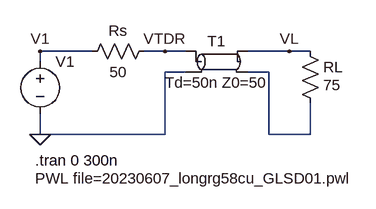
[diagram p0: schematic tline_test.asc]
tline_test.asc, the LTspice schematic file:
Version 4
SHEET 1 1272 680
WIRE 16 144 -64 144
WIRE 128 144 96 144
WIRE 160 144 128 144
WIRE 320 144 256 144
WIRE 352 144 320 144
WIRE -64 160 -64 144
WIRE 160 176 128 176
WIRE 288 176 256 176
WIRE -64 272 -64 240
WIRE 128 272 128 176
WIRE 128 272 -64 272
WIRE 288 272 288 176
WIRE 352 272 352 224
WIRE 352 272 288 272
FLAG -64 272 0
FLAG 320 144 VL
FLAG -64 144 V1
FLAG 128 144 VTDR
SYMBOL res 112 128 R90
WINDOW 0 0 56 VBottom 2
WINDOW 3 32 56 VTop 2
SYMATTR InstName Rs
SYMATTR Value 50
SYMBOL voltage -64 144 R0
WINDOW 123 0 0 Left 0
WINDOW 39 0 0 Left 0
WINDOW 3 -8 196 Left 2
SYMATTR Value PWL file=20230607_longrg58cu_GLSD01.pwl
SYMATTR InstName V1
SYMBOL res 336 128 R0
WINDOW 3 36 68 Left 2
SYMATTR Value 75
SYMATTR InstName RL
SYMBOL tline 208 160 R0
SYMATTR InstName T1
TEXT -72 312 Left 2 !.tran 0 300n

The netlist it stands for:
* tline_test.asc
Rs VTDR V1 50
V1 V1 0 PWL file=20230607_longrg58cu_GLSD01.pwl
RL VL N001 75
T1 VTDR 0 VL N001 Td=50n Z0=50
.tran 0 300n
.backanno
.end